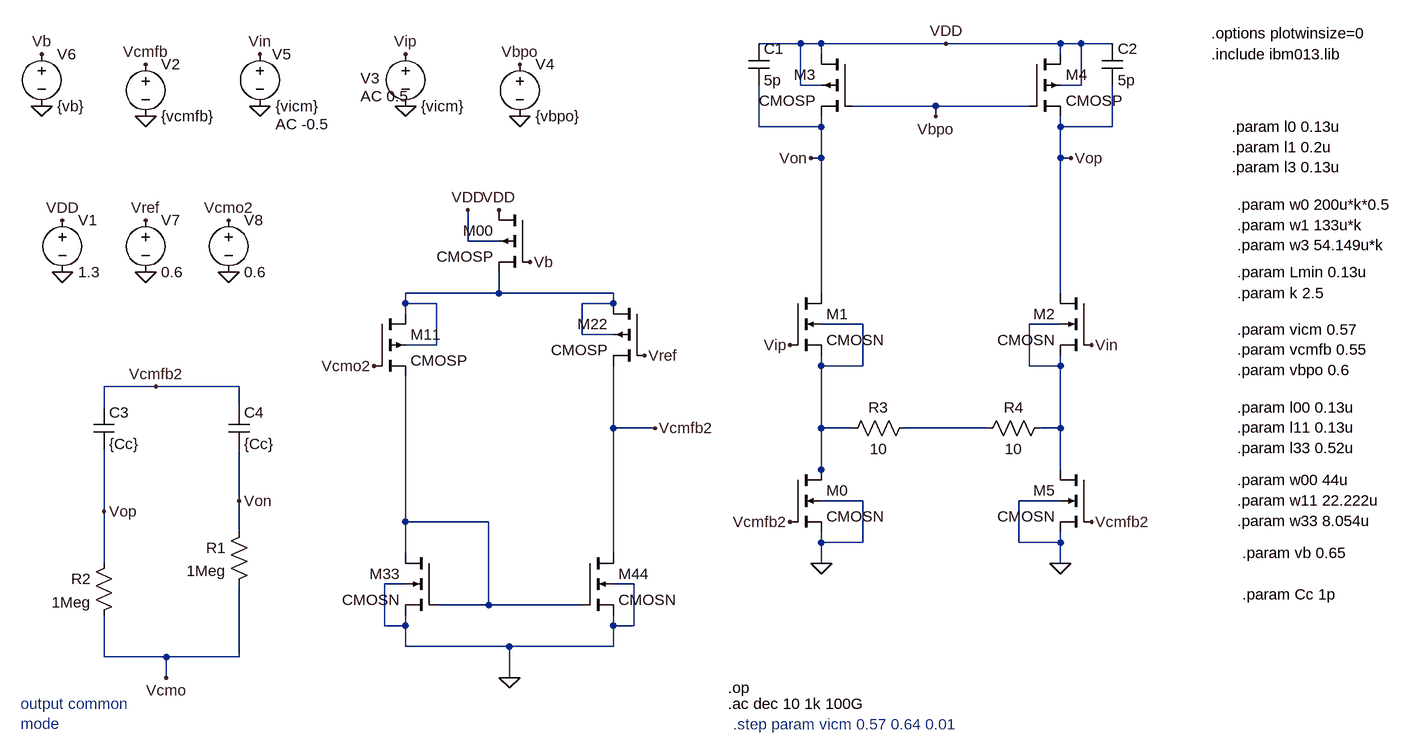
[diagram p0: schematic diff_opamp_config3.asc]
diff_opamp_config3.asc, the LTspice schematic file:
Version 4
SHEET 1 2232 1096
WIRE -16 -64 -80 -64
WIRE 16 -64 -16 -64
WIRE 208 -64 16 -64
WIRE 384 -64 208 -64
WIRE 416 -64 384 -64
WIRE 464 -64 416 -64
WIRE 16 -48 16 -64
WIRE 384 -48 384 -64
WIRE -16 0 -16 -64
WIRE 16 0 -16 0
WIRE 416 0 416 -64
WIRE 416 0 384 0
WIRE 192 32 64 32
WIRE 336 32 192 32
WIRE 192 48 192 32
WIRE -80 64 -80 0
WIRE 16 64 16 48
WIRE 16 64 -80 64
WIRE 384 64 384 48
WIRE 464 64 464 0
WIRE 464 64 384 64
WIRE 16 112 16 64
WIRE 16 112 0 112
WIRE 384 112 384 64
WIRE 400 112 384 112
WIRE -528 240 -528 192
WIRE -480 240 -528 240
WIRE -480 320 -480 288
WIRE -480 320 -624 320
WIRE -304 320 -480 320
WIRE 16 320 16 112
WIRE 384 320 384 112
WIRE -624 336 -624 320
WIRE -576 336 -624 336
WIRE -304 336 -304 320
WIRE -304 336 -352 336
WIRE -624 352 -624 336
WIRE 80 368 16 368
WIRE 384 368 336 368
WIRE -352 384 -352 336
WIRE -304 384 -352 384
WIRE -576 400 -576 336
WIRE -576 400 -624 400
WIRE 16 432 16 416
WIRE 80 432 80 368
WIRE 80 432 16 432
WIRE 336 432 336 368
WIRE 384 432 384 416
WIRE 384 432 336 432
WIRE -1008 464 -1088 464
WIRE -880 464 -1008 464
WIRE -1088 496 -1088 464
WIRE -880 496 -880 464
WIRE -304 528 -304 432
WIRE -240 528 -304 528
WIRE 16 528 16 432
WIRE 64 528 16 528
WIRE 272 528 144 528
WIRE 384 528 384 432
WIRE 384 528 352 528
WIRE 16 592 16 528
WIRE 384 592 384 528
WIRE 16 608 16 592
WIRE -880 640 -880 560
WIRE 80 640 16 640
WIRE 384 640 320 640
WIRE -1088 656 -1088 560
WIRE -624 672 -624 448
WIRE -496 672 -624 672
WIRE -880 688 -880 640
WIRE 16 704 16 688
WIRE 80 704 80 640
WIRE 80 704 16 704
WIRE 320 704 320 640
WIRE 384 704 384 688
WIRE 384 704 320 704
WIRE -624 720 -624 672
WIRE -304 720 -304 528
WIRE -1088 736 -1088 656
WIRE 16 736 16 704
WIRE 384 736 384 704
WIRE -624 768 -656 768
WIRE -272 768 -304 768
WIRE -496 800 -496 672
WIRE -496 800 -576 800
WIRE -352 800 -496 800
WIRE -656 832 -656 768
WIRE -624 832 -624 816
WIRE -624 832 -656 832
WIRE -304 832 -304 816
WIRE -272 832 -272 768
WIRE -272 832 -304 832
WIRE -624 864 -624 832
WIRE -464 864 -624 864
WIRE -304 864 -304 832
WIRE -304 864 -464 864
WIRE -1088 880 -1088 816
WIRE -992 880 -1088 880
WIRE -880 880 -880 768
WIRE -880 880 -992 880
WIRE -992 912 -992 880
WIRE -464 912 -464 864
FLAG 16 736 0
FLAG -1152 288 0
FLAG 192 48 Vbpo
FLAG 0 112 Von
FLAG 400 112 Vop
FLAG -32 672 Vcmfb2
FLAG -1024 48 0
FLAG -1024 -32 Vcmfb
FLAG -624 32 0
FLAG -448 48 0
FLAG -448 -32 Vbpo
FLAG -880 640 Von
FLAG -1088 656 Vop
FLAG -848 32 0
FLAG -1152 208 VDD
FLAG 208 -64 VDD
FLAG -624 -48 Vip
FLAG -32 400 Vip
FLAG -848 -48 Vin
FLAG 432 400 Vin
FLAG -528 192 VDD
FLAG -480 192 VDD
FLAG -1184 32 0
FLAG -1184 -48 Vb
FLAG -464 912 0
FLAG -1024 288 0
FLAG -1024 208 Vref
FLAG -240 528 Vcmfb2
FLAG -256 416 Vref
FLAG -992 912 Vcmo
FLAG -672 432 Vcmo2
FLAG -896 288 0
FLAG -896 208 Vcmo2
FLAG -432 272 Vb
FLAG -1008 464 Vcmfb2
FLAG 384 736 0
FLAG 432 672 Vcmfb2
DATAFLAG 16 208 ""
DATAFLAG -992 880 ""
DATAFLAG 384 208 ""
DATAFLAG -624 576 ""
SYMBOL cmosn -32 320 R0
SYMATTR InstName M1
SYMATTR Value2 l={l1} w={w1} ad={2*w1*Lmin} as={2*w1*Lmin} pd={2*w1+4*Lmin} ps={2*w1+4*Lmin}
SYMBOL cmosp 64 -48 M0
SYMATTR InstName M3
SYMATTR Value2 l={l3} w={w3} ad={2*w3*Lmin} as={2*w3*Lmin} pd={2*w3+4*Lmin} ps={2*w3+4*Lmin}
SYMBOL voltage -1152 192 R0
SYMATTR InstName V1
SYMATTR Value 1.3
SYMBOL cmosp 336 -48 R0
SYMATTR InstName M4
SYMATTR Value2 l={l3} w={w3} ad={2*w3*Lmin} as={2*w3*Lmin} pd={2*w3+4*Lmin} ps={2*w3+4*Lmin}
SYMBOL cmosn 432 320 M0
SYMATTR InstName M2
SYMATTR Value2 l={l1} w={w1} ad={2*w1*Lmin} as={2*w1*Lmin} pd={2*w1+4*Lmin} ps={2*w1+4*Lmin}
SYMBOL cmosn -32 592 R0
SYMATTR InstName M0
SYMATTR Value2 l={l0} w={w0} ad={2*w0*Lmin} as={2*w0*Lmin} pd={2*w0+4*Lmin} ps={2*w0+4*Lmin}
SYMBOL voltage -1024 -48 R0
WINDOW 123 24 124 Left 2
WINDOW 39 0 0 Left 0
SYMATTR InstName V2
SYMATTR Value {vcmfb}
SYMBOL cap -96 -64 R0
SYMATTR InstName C1
SYMATTR Value 5p
SYMBOL cap 448 -64 R0
SYMATTR InstName C2
SYMATTR Value 5p
SYMBOL voltage -624 -64 R0
WINDOW 123 -69 81 Left 2
WINDOW 39 0 0 Left 0
WINDOW 0 -69 53 Left 2
SYMATTR Value2 AC 0.5
SYMATTR InstName V3
SYMATTR Value {vicm}
SYMBOL voltage -448 -48 R0
WINDOW 123 0 0 Left 0
WINDOW 39 0 0 Left 0
SYMATTR InstName V4
SYMATTR Value {vbpo}
SYMBOL res -864 672 M0
SYMATTR InstName R1
SYMATTR Value 1Meg
SYMBOL res -1072 720 M0
SYMATTR InstName R2
SYMATTR Value 1Meg
SYMBOL voltage -848 -64 R0
WINDOW 123 24 124 Left 2
WINDOW 39 0 0 Left 0
WINDOW 0 19 16 Left 2
SYMATTR Value2 AC -0.5
SYMATTR InstName V5
SYMATTR Value {vicm}
SYMBOL cmosp -672 352 R0
SYMATTR InstName M11
SYMATTR Value2 l={l11} w={w11} ad={2*Lmin*w11} as={2*Lmin*w11} pd={2*w11+4*Lmin} ps={2*w11+4*Lmin}
SYMBOL cmosp -432 192 M0
SYMATTR InstName M00
SYMATTR Value2 l={l00} w={w00} ad={2*Lmin*w00} as={2*Lmin*w00} pd={2*w00+4*Lmin} ps={2*w00+4*Lmin}
SYMBOL cmosn -576 720 M0
SYMATTR InstName M33
SYMATTR Value2 l={l33} w={w33} ad={2*Lmin*w33} as={2*Lmin*w33} pd={2*w33+4*Lmin} ps={2*w33+4*Lmin}
SYMBOL voltage -1184 -64 R0
WINDOW 123 0 0 Left 0
WINDOW 39 0 0 Left 0
SYMATTR InstName V6
SYMATTR Value {vb}
SYMBOL voltage -1024 192 R0
WINDOW 123 0 0 Left 0
WINDOW 39 0 0 Left 0
SYMATTR InstName V7
SYMATTR Value 0.6
SYMBOL voltage -896 192 R0
WINDOW 123 24 124 Left 2
WINDOW 39 0 0 Left 0
SYMATTR InstName V8
SYMATTR Value 0.6
SYMBOL cmosn -352 720 R0
SYMATTR InstName M44
SYMATTR Value2 l={l33} w={w33} ad={2*Lmin*w33} as={2*Lmin*w33} pd={2*w33+4*Lmin} ps={2*w33+4*Lmin}
SYMBOL cmosp -256 336 M0
SYMATTR InstName M22
SYMATTR Value2 l={l11} w={w11} ad={2*Lmin*w11} as={2*Lmin*w11} pd={2*w11+4*Lmin} ps={2*w11+4*Lmin}
SYMBOL cap -1104 496 R0
SYMATTR InstName C3
SYMATTR Value {Cc}
SYMBOL cap -896 496 R0
SYMATTR InstName C4
SYMATTR Value {Cc}
SYMBOL res 160 512 R90
WINDOW 0 0 56 VBottom 2
WINDOW 3 32 56 VTop 2
SYMATTR InstName R3
SYMATTR Value 10
SYMBOL res 368 512 R90
WINDOW 0 0 56 VBottom 2
WINDOW 3 32 56 VTop 2
SYMATTR InstName R4
SYMATTR Value 10
SYMBOL cmosn 432 592 M0
SYMATTR InstName M5
SYMATTR Value2 l={l0} w={w0} ad={2*w0*Lmin} as={2*w0*Lmin} pd={2*w0+4*Lmin} ps={2*w0+4*Lmin}
TEXT 616 -48 Left 2 !.include ibm013.lib
TEXT 656 288 Left 2 !.param Lmin 0.13u
TEXT 648 64 Left 2 !.param l0 0.13u\n.param l1 0.2u\n.param l3 0.13u
TEXT 616 -80 Left 2 !.options plotwinsize=0
TEXT 656 184 Left 2 !.param w0 200u*k*0.5\n.param w1 133u*k\n.param w3 54.149u*k
TEXT 656 320 Left 2 !.param k 2.5
TEXT 656 376 Left 2 !.param vicm 0.57\n.param vcmfb 0.55\n.param vbpo 0.6
TEXT -128 952 Left 2 !.ac dec 10 1k 100G
TEXT 656 496 Left 2 !.param l00 0.13u\n.param l11 0.13u\n.param l33 0.52u
TEXT 656 608 Left 2 !.param w00 44u\n.param w11 22.222u\n.param w33 8.054u
TEXT 664 720 Left 2 !.param vb 0.65
TEXT -128 928 Left 2 !.op
TEXT 664 784 Left 2 !.param Cc 1p
TEXT -1216 952 Left 2 ;output common\nmode
TEXT -120 984 Left 2 ;.step param vicm 0.57 0.64 0.01

The netlist it stands for:
* diff_opamp_config3.asc
M1 Von Vip N002 N002 CMOSN l={l1} w={w1} ad={2*w1*Lmin} as={2*w1*Lmin} pd={2*w1+4*Lmin} ps={2*w1+4*Lmin}
M3 VDD Vbpo Von VDD CMOSP l={l3} w={w3} ad={2*w3*Lmin} as={2*w3*Lmin} pd={2*w3+4*Lmin} ps={2*w3+4*Lmin}
V1 VDD 0 1.3
M4 VDD Vbpo Vop VDD CMOSP l={l3} w={w3} ad={2*w3*Lmin} as={2*w3*Lmin} pd={2*w3+4*Lmin} ps={2*w3+4*Lmin}
M2 Vop Vin N003 N003 CMOSN l={l1} w={w1} ad={2*w1*Lmin} as={2*w1*Lmin} pd={2*w1+4*Lmin} ps={2*w1+4*Lmin}
M0 N002 Vcmfb2 0 0 CMOSN l={l0} w={w0} ad={2*w0*Lmin} as={2*w0*Lmin} pd={2*w0+4*Lmin} ps={2*w0+4*Lmin}
V2 Vcmfb 0 {vcmfb}
C1 VDD Von 5p
C2 VDD Vop 5p
V3 Vip 0 {vicm} AC 0.5
V4 Vbpo 0 {vbpo}
R1 Von Vcmo 1Meg
R2 Vop Vcmo 1Meg
V5 Vin 0 {vicm} AC -0.5
M11 N001 Vcmo2 N005 N001 CMOSP l={l11} w={w11} ad={2*Lmin*w11} as={2*Lmin*w11} pd={2*w11+4*Lmin} ps={2*w11+4*Lmin}
M00 VDD Vb N001 VDD CMOSP l={l00} w={w00} ad={2*Lmin*w00} as={2*Lmin*w00} pd={2*w00+4*Lmin} ps={2*w00+4*Lmin}
M33 N005 N005 0 0 CMOSN l={l33} w={w33} ad={2*Lmin*w33} as={2*Lmin*w33} pd={2*w33+4*Lmin} ps={2*w33+4*Lmin}
V6 Vb 0 {vb}
V7 Vref 0 0.6
V8 Vcmo2 0 0.6
M44 Vcmfb2 N005 0 0 CMOSN l={l33} w={w33} ad={2*Lmin*w33} as={2*Lmin*w33} pd={2*w33+4*Lmin} ps={2*w33+4*Lmin}
M22 N001 Vref Vcmfb2 N001 CMOSP l={l11} w={w11} ad={2*Lmin*w11} as={2*Lmin*w11} pd={2*w11+4*Lmin} ps={2*w11+4*Lmin}
C3 Vcmfb2 Vop {Cc}
C4 Vcmfb2 Von {Cc}
R3 N004 N002 10
R4 N003 N004 10
M5 N003 Vcmfb2 0 0 CMOSN l={l0} w={w0} ad={2*w0*Lmin} as={2*w0*Lmin} pd={2*w0+4*Lmin} ps={2*w0+4*Lmin}
.model NMOS NMOS
.model PMOS PMOS
.lib standard.mos
.include ibm013.lib
.param Lmin 0.13u
.param l0 0.13u
.param l1 0.2u
.param l3 0.13u
.options plotwinsize=0
.param w0 200u*k*0.5
.param w1 133u*k
.param w3 54.149u*k
.param k 2.5
.param vicm 0.57
.param vcmfb 0.55
.param vbpo 0.6
.ac dec 10 1k 100G
.param l00 0.13u
.param l11 0.13u
.param l33 0.52u
.param w00 44u
.param w11 22.222u
.param w33 8.054u
.param vb 0.65
.op
.param Cc 1p
* output common
* mode
* .step param vicm 0.57 0.64 0.01
.backanno
.end